# EAGLE design LoRa ST v1.0 (EAGLE 7.5.0)
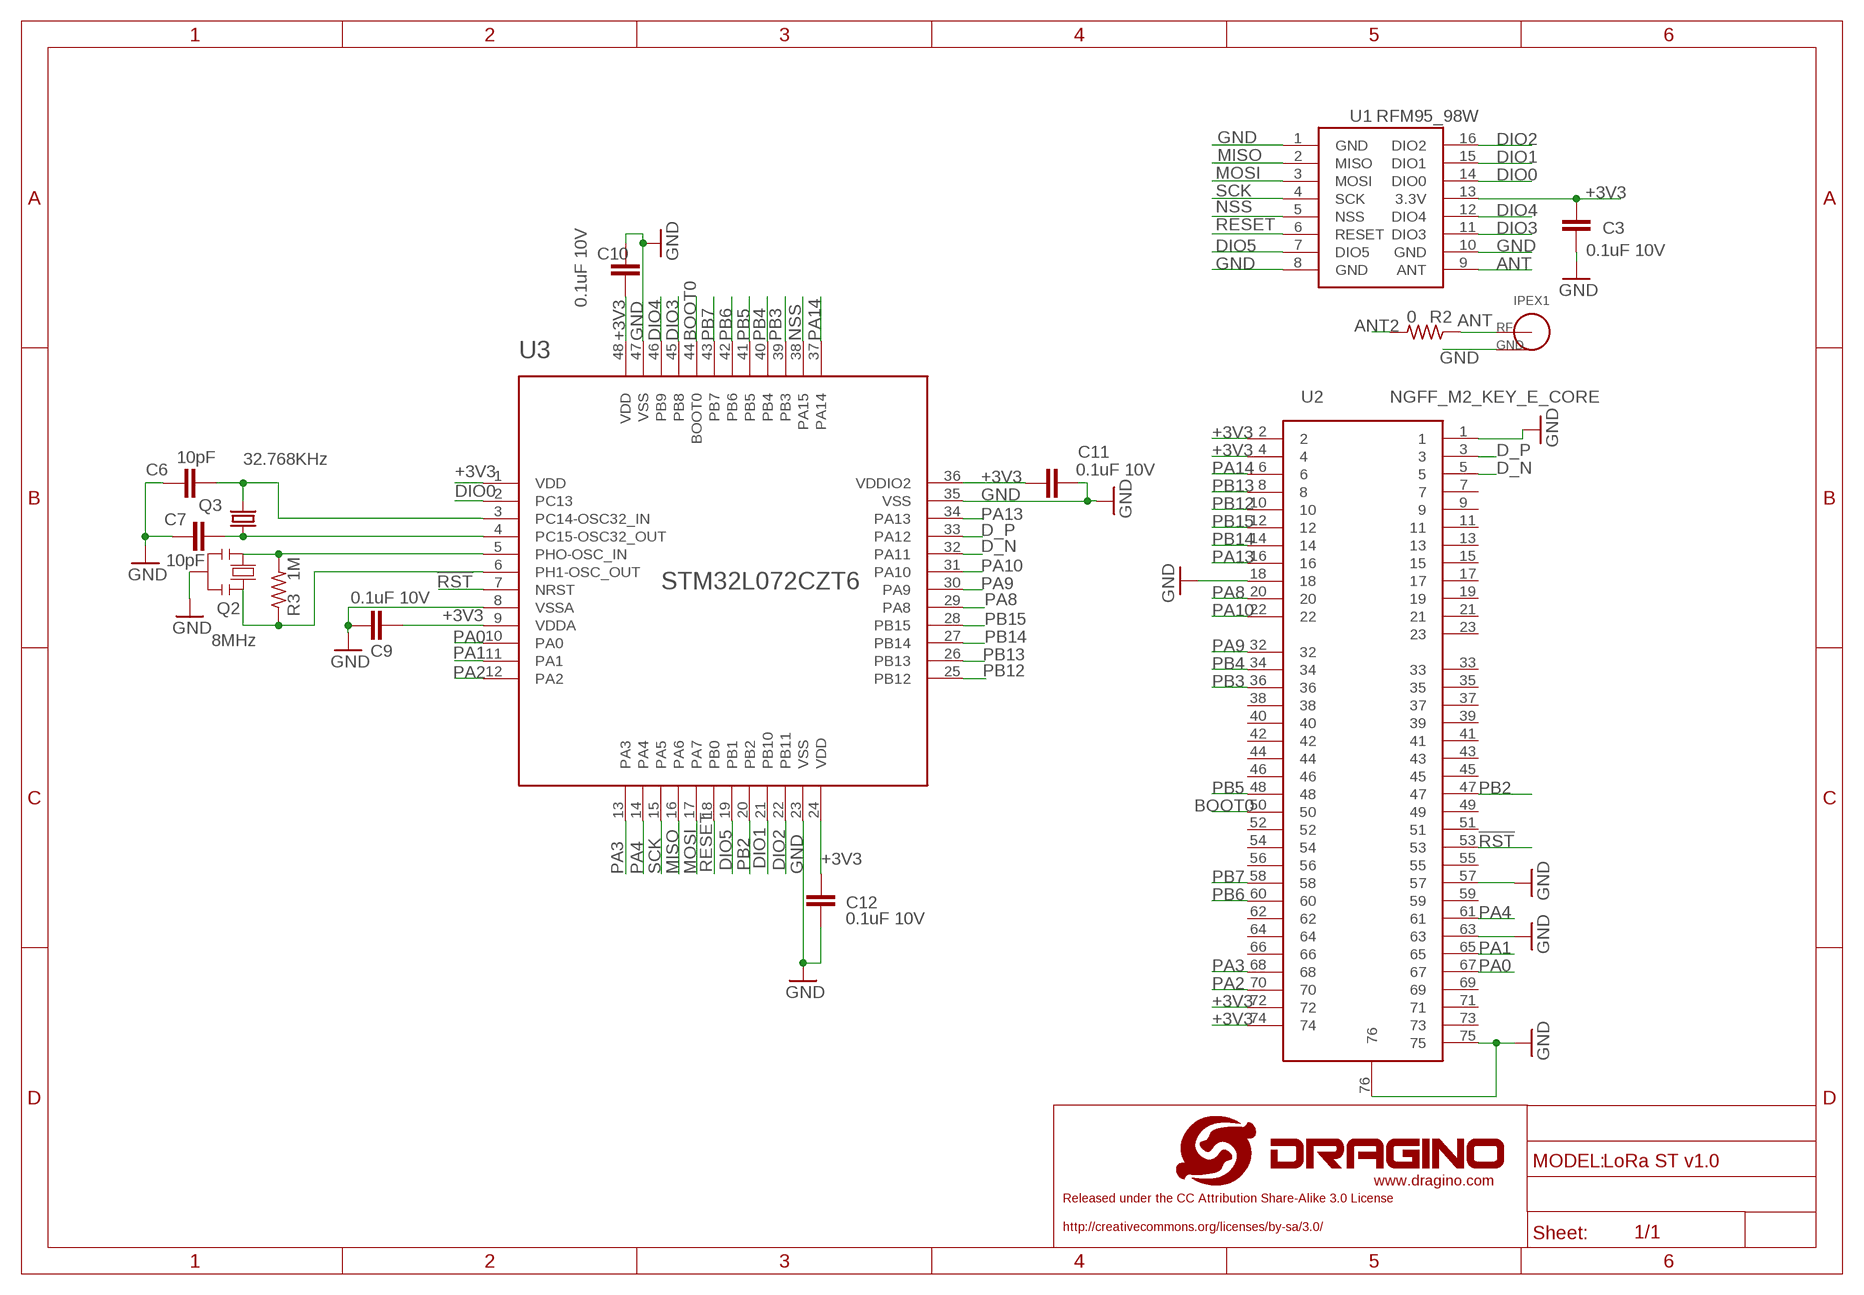
[diagram p0: schematic, sheet 1]

## Parts
C3  0.1uF 10V  C-EUC0402  [C0402]
C6  10pF  C-EUC0402  [C0402]
C7  10pF  C-EUC0402  [C0402]
C9  0.1uF 10V  C-EUC0402  [C0402]
C10  0.1uF 10V  C-EUC0402  [C0402]
C11  0.1uF 10V  C-EUC0402  [C0402]
C12  0.1uF 10V  C-EUC0402  [C0402]
IPEX1  I-PEX4  [I-PEX4]
Q2  8MHz  RESONATORMU  [RESONATOR]
Q3  32.768KHz  SMD-2012_2P  [32.768K]
R2  0  R-US_R0402  [R0402]
R3  1M  R-US_R0402  [R0402]
U1  RFM95_98W  [RFM95_98W]
U2  NGFF_M2_KEY_E_CORE  [LORA_ST_PCB]
U3  STM32L072CZT6  STM32L0XX  [LQFP48]
U$2  LOGO-NEW  [LOGO-SILK-NEW]

## Nets
!RST: U2.53 U3.7(NRST)
+3V3: C3.2 C9.1 C10.1 C11.2 C12.2 U1.13(3.3V) U2.2 U2.4 U2.72 U2.74 U3.1(VDD) U3.9(VDDA) U3.24(VDD) U3.36(VDDIO2) U3.48(VDD)
ANT [2layer-50ohm]: IPEX1.SIG R2.1 U1.9(ANT)
ANT2: R2.2
BOOT0: U2.50 U3.44(BOOT0)
D_N: U2.5 U3.32(PA11)
D_P: U2.3 U3.33(PA12)
DIO0: U1.14(DIO0) U3.2(PC13)
DIO1: U1.15(DIO1) U3.21(PB10)
DIO2: U1.16(DIO2) U3.22(PB11)
DIO3: U1.11(DIO3) U3.45(PB8)
DIO4: U1.12(DIO4) U3.46(PB9)
DIO5: U1.7(DIO5) U3.19(PB1)
GND: C3.1 C6.1 C7.1 C9.2 C10.2 C11.1 C12.1 IPEX1.GND1(GND) IPEX1.GND2(GND) IPEX1.GND3(GND) Q2.2 U1.1(GND) U1.8(GND) U1.10(GND) U2.1 U2.18 U2.57 U2.63 U2.75 U2.76 U3.8(VSSA) U3.23(VSS) U3.35(VSS) U3.47(VSS)
MISO: U1.2(MISO) U3.16(PA6)
MOSI: U1.3(MOSI) U3.17(PA7)
N$4: Q2.1 R3.2 U3.5(PHO-OSC_IN)
N$5: Q2.3 R3.1 U3.6(PH1-OSC_OUT)
N$6: C7.2 Q3.3 U3.4(PC15-OSC32_OUT)
N$7: C6.2 Q3.4 U3.3(PC14-OSC32_IN)
NSS: U1.5(NSS) U3.38(PA15)
PA0: U2.67 U3.10(PA0)
PA1: U2.65 U3.11(PA1)
PA2: U2.70 U3.12(PA2)
PA3: U2.68 U3.13(PA3)
PA4: U2.61 U3.14(PA4)
PA8: U2.20 U3.29(PA8)
PA9: U2.32 U3.30(PA9)
PA10: U2.22 U3.31(PA10)
PA13: U2.16 U3.34(PA13)
PA14: U2.6 U3.37(PA14)
PB2: U2.47 U3.20(PB2)
PB3: U2.36 U3.39(PB3)
PB4: U2.34 U3.40(PB4)
PB5: U2.48 U3.41(PB5)
PB6: U2.60 U3.42(PB6)
PB7: U2.58 U3.43(PB7)
PB12: U2.10 U3.25(PB12)
PB13: U2.8 U3.26(PB13)
PB14: U2.14 U3.27(PB14)
PB15: U2.12 U3.28(PB15)
RESET: U1.6(RESET) U3.18(PB0)
SCK: U1.4(SCK) U3.15(PA5)
Unconnected: U2.7 U2.9 U2.11 U2.13 U2.15 U2.17 U2.19 U2.21 U2.23 U2.33 U2.35 U2.37 U2.38 U2.39 U2.40 U2.41 U2.42 U2.43 U2.44 U2.45 U2.46 U2.49 U2.51 U2.52 U2.54 U2.55 U2.56 U2.59 U2.62 U2.64 U2.66 U2.69 U2.71 U2.73

## Library data of the parts
C3 C6 C7 C9-C12 = dragino-passive:C-EU: CAPACITOR, European symbol
IPEX1 = dragino-passive:I-PEX: I-PEX, U.F.L connector
Q2 = SmartPrj:RESONATOR
Q3 = crystal:SMD-2012_2P: kHz RANGE CRYSTAL UNIT SMD Source: MC-306_405_406_E07X.PDF Homepage <http://www.epsontoyocom.co.jp>
R2 R3 = dragino:R-US_: RESISTOR, American symbol
U1 = dragino:RFM95_98W
U2 = dragino:NGFF_M2_KEY_E
U3 = dragino:STM32L0XX
U$2 = dragino:LOGO-NEW

## Net classes
0 default: width 0.203 mm, clearance 0.203 mm
1 vcc: width 0.254 mm
2 gnd: width 0.305 mm, drill 0.254 mm, clearance 0.203 mm
3 2layer-50ohm: width 0.305 mm, clearance 0.203 mm

## Board
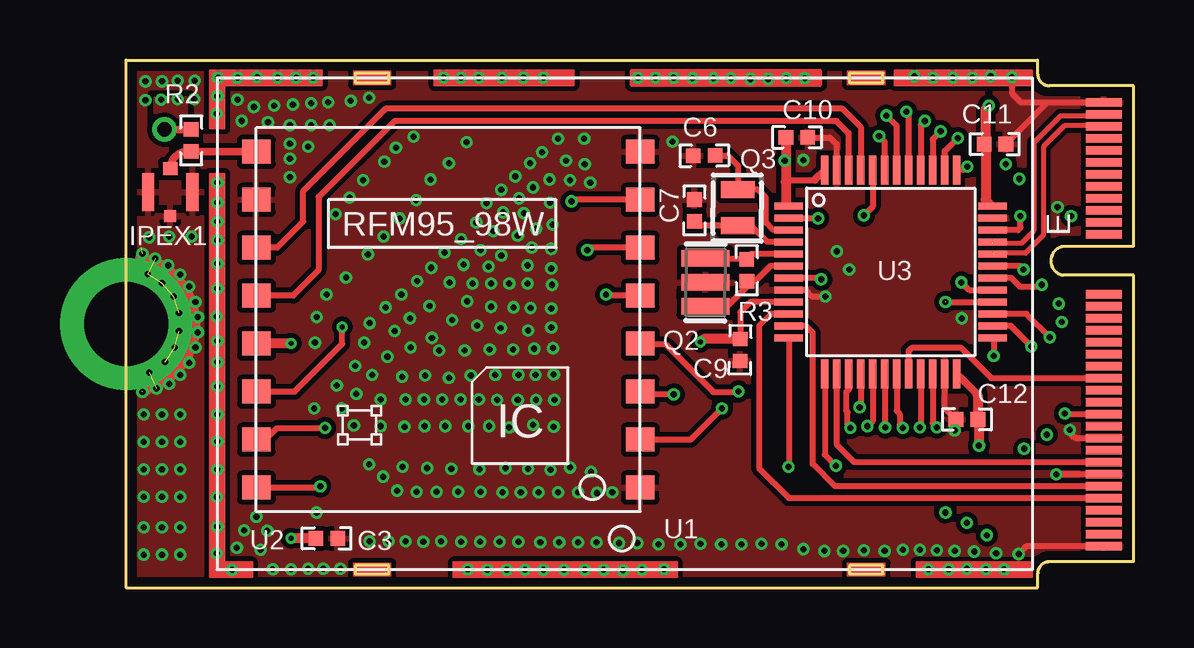
[diagram p1: board, top side]
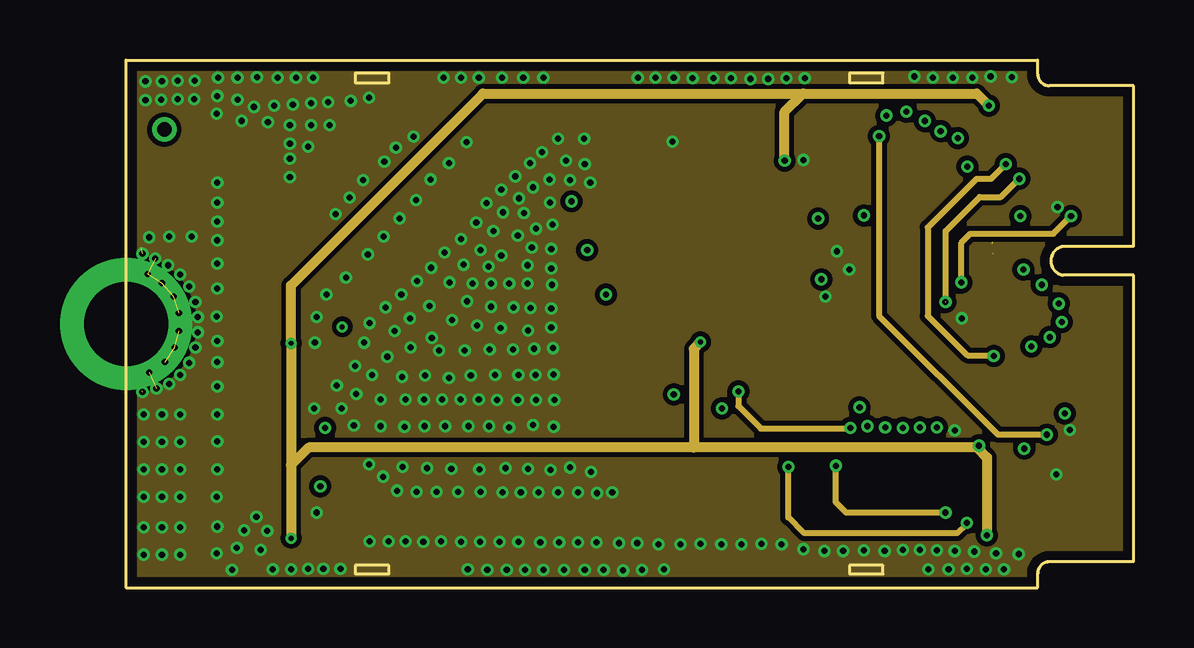
[diagram p2: board, inner layer Route2]
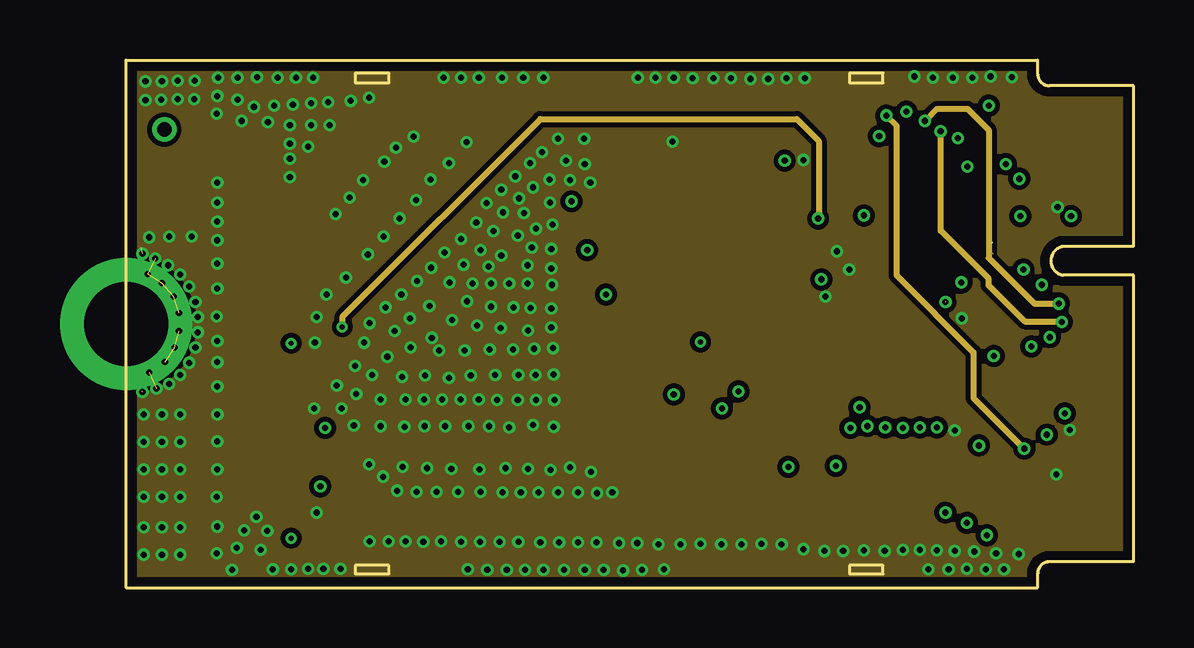
[diagram p3: board, inner layer Route15]
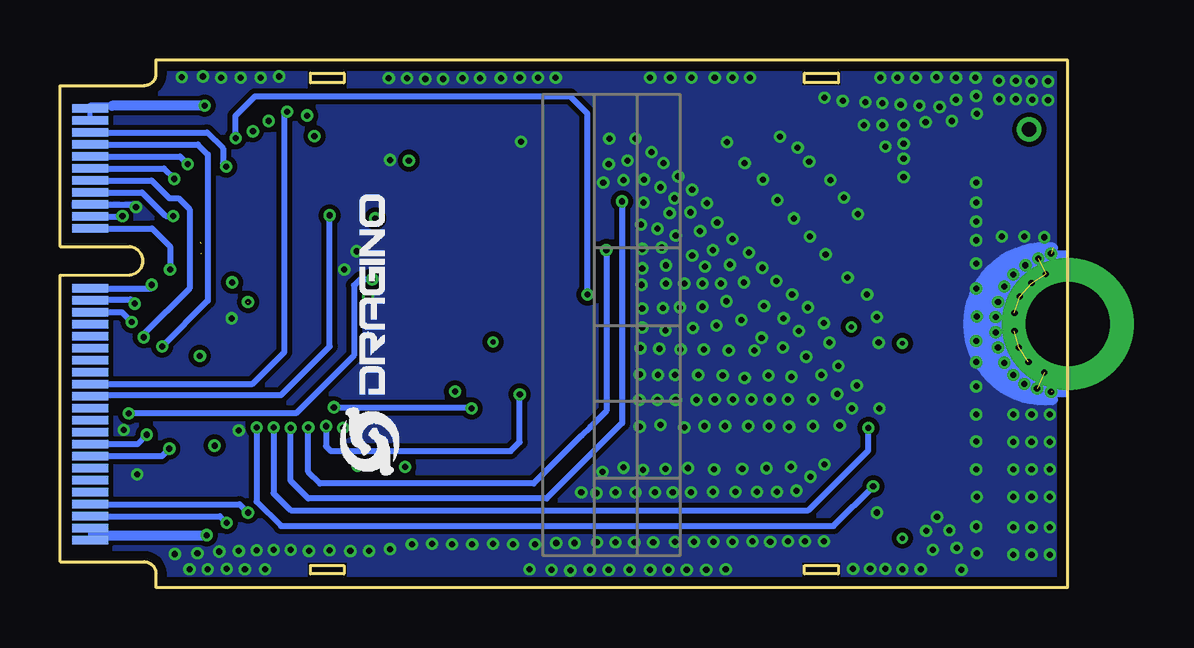
[diagram p4: board, bottom side, seen from below]

Size 42 x 22 mm. Coordinates in mm from the lower left corner, seen from the top.
Copper layers (1*2+15*16): Top 0.035mm / dielectric 1.5mm / Route2 0.035mm / dielectric 0.15mm / Route15 0.035mm / dielectric 0.2mm / Bottom 0.035mm
Design rules "default *": minimum track width 6mil, minimum drill 8mil, track to track 6mil, track to pad 6mil, pad to pad 6mil, via to via 6mil, smd to smd 6mil, copper to edge 15mil, drill to drill 8mil, minimum pad ring 5mil, minimum via ring 5mil, stop-mask expansion 4mil, vias tented up to drill 30mil, thermal gap 8mil
tRestrict: 4 lines

### Footprints (pad centres in the part's own frame; a part is rotated, then mirrored left to right if it is on the bottom)
C0402 = smd 0.61 x 0.61: 1 -0.457,0; 2 0.457,0
I-PEX4 = smd 0.508 x 1.58: GND1 -0.924,0; GND3 0.924,0 | smd 0.5 x 0.5: GND2 0,1 | smd 0.6 x 0.55: SIG 0,-0.975
RESONATOR = smd 0.7 x 2: 1 -1,0; 2 0,0; 3 1,0
32.768K = smd 0.7 x 1.4: 3 0.78,0.03; 4 -0.72,0.03
R0402 = smd 0.61 x 0.61: 1 -0.457,0; 2 0.457,0
RFM95_98W = smd 1.2 x 1: 1 -8,5.73; 2 -8,3.73; 3 -8,1.73; 4 -8,-0.27; 5 -8,-2.27; 6 -8,-4.27; 7 -8,-6.27; 8 -8,-8.27; 9 8,-8.27; 10 8,-6.27; 11 8,-4.27; 12 8,-2.27; 13 8,-0.27; 14 8,1.73; 15 8,3.73; 16 8,5.73
LORA_ST_PCB = smd 0.35 x 1.5: 1 20.225,-40.75; 3 19.725,-40.75; 5 19.225,-40.75; 7 18.725,-40.75; 9 18.225,-40.75; 11 17.725,-40.75; 13 17.227,-40.75; 15 16.725,-40.75; 17 16.225,-40.75; 19 15.725,-40.75; 21 15.225,-40.75; 23 14.725,-40.75; 33 12.225,-40.75; 35 11.725,-40.75; 37 11.225,-40.75; 39 10.725,-40.75; 41 10.225,-40.75; 43 9.725,-40.75; 45 9.225,-40.75; 47 8.725,-40.75; 49 8.225,-40.75; 51 7.725,-40.75; 53 7.225,-40.75; 55 6.725,-40.75; 57 6.225,-40.75; 59 5.725,-40.75; 61 5.225,-40.75; 63 4.725,-40.75; 65 4.225,-40.75; 67 3.725,-40.75; 69 3.225,-40.75; 71 2.725,-40.75; 73 2.225,-40.75; 75 1.725,-40.75 | smd 0.35 x 1.5 bottom: 2 19.975,-40.75; 4 19.475,-40.75; 6 18.975,-40.75; 8 18.475,-40.75; 10 17.975,-40.75; 12 17.475,-40.75; 14 16.975,-40.75; 16 16.475,-40.75; 18 15.975,-40.75; 20 15.475,-40.75; 22 14.975,-40.75; 32 12.475,-40.75; 34 11.975,-40.75; 36 11.475,-40.75; 38 10.975,-40.75; 40 10.475,-40.75; 42 9.975,-40.75; 44 9.475,-40.75; 46 8.975,-40.75; 48 8.475,-40.75; 50 7.975,-40.75; 52 7.475,-40.75; 54 6.975,-40.75; 56 6.475,-40.75; 58 5.975,-40.75; 60 5.475,-40.75; 62 4.975,-40.75; 64 4.475,-40.75; 66 3.975,-40.75; 68 3.475,-40.75; 70 2.975,-40.75; 72 2.475,-40.75; 74 1.975,-40.75 | drill 3.5 pad 5.5: 76 11,0
LQFP48 = smd 1.2 x 0.3: 1 -4.25,2.75; 2 -4.25,2.25; 3 -4.25,1.75; 4 -4.25,1.25; 5 -4.25,0.75; 6 -4.25,0.25; 7 -4.25,-0.25; 8 -4.25,-0.75; 9 -4.25,-1.25; 10 -4.25,-1.75; 11 -4.25,-2.25; 12 -4.25,-2.75; 25 4.25,-2.75; 26 4.25,-2.25; 27 4.25,-1.75; 28 4.25,-1.25; 29 4.25,-0.75; 30 4.25,-0.25; 31 4.25,0.25; 32 4.25,0.75; 33 4.25,1.25; 34 4.25,1.75; 35 4.25,2.25; 36 4.25,2.75 | smd 0.3 x 1.2: 13 -2.75,-4.25; 14 -2.25,-4.25; 15 -1.75,-4.25; 16 -1.25,-4.25; 17 -0.75,-4.25; 18 -0.25,-4.25; 19 0.25,-4.25; 20 0.75,-4.25; 21 1.25,-4.25; 22 1.75,-4.25; 23 2.25,-4.25; 24 2.75,-4.25; 37 2.75,4.25; 38 2.25,4.25; 39 1.75,4.25; 40 1.25,4.25; 41 0.75,4.25; 42 0.25,4.25; 43 -0.25,4.25; 44 -0.75,4.25; 45 -1.25,4.25; 46 -1.75,4.25; 47 -2.25,4.25; 48 -2.75,4.25

### Placement (x,y rotation side)
C3  8.37,2.05 180 top
C6  24.1,18.01 0.6 top
C7  23.7,15.72 270 top
C9  25.6,9.91 269.2 top
C10  27.97,18.77 0 top
C11  36.22,18.49 180 top
C12  35.05,7.01 0 top
IPEX1  1.85,16.5 180 top
Q2  24.16,12.73 269.7 top
Q3  25.48,15.88 269.8 top
R2  2.72,18.64 90 top
R3  25.88,13.23 90.1 top
U1  13.44,9.91 180 top
U2  0,0 90 top
U3  31.88,13.16 0 top
U$1  [LORA_ST]  3.8,0.75 0 top
U$2  27.86,4.67 90 bottom

### Tracks (layer width: path | path; a pad name or v marks a point on that pad's centre or on a via)
!RST  (via drill 0.25 pad 0.25)
  Top 0.254: 39.18,7.23 v39.14,7.26 39.14,7.23 U2.53 | U3.7 27.63,12.89 27.67,12.93 28.91,12.93 arc-90 v28.98,12.85
  Bottom 0.254: v28.98,12.85 29.49,12.85 29.74,12.6 29.74,9.68 32.16,7.26 v39.14,7.26
+3V3  (via drill 0.2 pad 0.25, 0.25, 0.25 pad 0.25)
  Top 0.254: 35.46,7.06 C12.2 35.56,6.96 | 35.84,18.42 C11.2 | v6.89,2.05 v6.88,2.06 | v27.46,17.81 27.51,17.81 | 27.51,16.92 27.56,16.96 28.73,16.96 28.73,17.01 | 25.63,10.38 C9.1 25.61,11.49 26.04,11.91 U3.9 | U3.1 27.59,15.91 27.51,15.99
  Top 0.305: U3.36 35.84,16.19 | U3.24 35.51,8.03 | 28.73,17.01 U3.48
  Top 0.406: C10.1 27.51,17.81 27.51,16.92 27.51,15.99 | C3.2 v6.89,2.05 | v6.88,10.19 U1.13 | v35.97,20.09 35.84,19.96 35.84,18.49 | 35.84,18.49 35.84,16.19 | C11.2 35.84,18.49 | 35.51,8.03 C12.2 | 35.56,6.96 v35.56,5.92 | C9.1 24.08,10.36 v23.95,10.24
  Top 0.508: U1.13
  Route2 0.406: v27.46,17.81 27.46,19.84 28.22,20.6 | 28.22,20.6 35.46,20.6 v35.97,20.09 | 28.22,20.6 14.88,20.6 6.88,12.6 v6.88,10.19 6.88,5.11 | 6.88,5.11 v6.88,2.06 | v35.56,5.92 35.48,5.84 | 35.48,5.84 35.89,5.44 v35.89,2.18 | 35.48,5.84 23.67,5.84 | 23.67,5.84 7.62,5.84 6.88,5.11 | v23.95,10.24 23.67,9.96 23.67,5.84
  Bottom 0.203: U2.72 U2.74 | U2.4 U2.2
  Bottom 0.254: 39.83,20.09 40.74,20.09 | U2.2 40.75,20.09 40.74,20.09 | 40.74,20.09 40.74,19.89 40.77,19.89 | U2.72 40.46,2.18
  Bottom 0.406: v35.97,20.09 39.83,20.09 | 40.46,2.18 v35.89,2.18
ANT
  Top 0.305: U1.9 2.72,18.18 | 2.55,18.18 arc90 IPEX1.SIG
  Top 0.406: R2.1 2.72,18.18 2.55,18.18
ANT2  (via drill 0.6 pad 1.02)
  Top 0.305: R2.2 v1.6,19.1
BOOT0  (via drill 0.25 pad 0.25)
  Top 0.254: U3.44 31.13,15.89 v30.76,15.52
  Bottom 0.254: U2.50 40.75,8.03 32.79,8.03 30.76,10.06 v30.76,15.52
D_N  (1 unrouted)
  Top 0.203: U2.5 40.72,19.25 39.12,19.25 38.25,18.38 38.25,14.7 37.49,13.94 36.12,13.94
D_P  (1 unrouted)
  Top 0.203: U2.3 40.68,19.66 38.96,19.66 37.84,18.54 37.84,14.87 37.32,14.35 36.12,14.35
DIO0  (via drill 0.2 pad 0.25, 0.25 pad 0.25)
  Top 0.254: U1.14 7.03,8.18 9.02,10.16 v9.02,10.87 | v28.85,15.39 27.64,15.39 U3.2
  Route15 0.254: v28.85,15.39 28.88,15.42 28.88,18.62 27.97,19.53 17.27,19.53 9.02,11.28 v9.02,10.87
DIO1  (via drill 0.25)
  Top 0.254: U3.21 33.13,6.71 v33.1,6.68 | U1.15 5.82,6.18 6.3,6.65 v8.31,6.65
  Bottom 0.254: v33.1,6.68 33.1,3.94 32.39,3.23 10.8,3.23 8.31,5.72 v8.31,6.65
DIO2  (via drill 0.25)
  Top 0.254: U3.22 33.63,6.86 v33.81,6.68 | U1.16 8.06,4.18 v8.1,4.22
  Bottom 0.254: v33.81,6.68 33.81,3.58 32.79,2.57 9.75,2.57 v8.1,4.22
DIO3
  Top 0.254: U1.11 6.3,14.18 7.39,15.27 7.39,16.54 10.82,19.96 29.87,19.96 30.63,19.2 U3.45
DIO4
  Top 0.254: U1.12 6.97,12.18 8.03,13.23 8.03,16.28 11.2,19.46 29.62,19.46 30.12,18.95 U3.46
DIO5  (via drill 0.25)
  Top 0.254: U3.19 32.13,7.37 32.26,7.24 32.26,6.78 v32.39,6.65 | U1.7 18.64,16.18 v18.57,16.1
  Bottom 0.254: v32.39,6.65 32.39,4.45 31.65,3.71 21.72,3.71 18.57,6.86 v18.57,16.1
GND  (via drill 0.25)  (9 unrouted)
  Top 0.254: 36.73,18.49 C11.1 38.41,20.23 | U2.57 39.7,6.23 arc-90 v39.34,6.58 | C10.2 29.34,18.77 29.62,18.49 U3.47 | C12.1 34.13,7.48 U3.23 | U2.1 38.41,20.23 | 38.41,20.23 37.33,20.23 36.96,20.6 36.96,21.26 v36.93,21.29 | U3.8 27.64,12.42 28.32,12.42 28.6,12.14 v29.16,12.14 | U2.63 v38.79,4.73 v38.79,4.72 | U2.75 37.54,1.73 v37.21,1.4
  Top 0.406: 0.61,13.77 arc-156 0.66,8.2
  Bottom 0.254: U2.18 38.94,15.98 v38.83,15.87
  Bottom 0.406: 0.61,14.17 arc-192 0.61,7.82
  other vias: 22.78,18.59 28.24,17.83 29.64,14.02 1.75,13.44 2.26,13.06 2.64,12.55 2.9,11.91 3,11.28 3,10.64 2.9,10.01 2.64,9.37 2.26,8.86 1.8,8.48 3.81,12.47 3.78,11.3 3.81,10.29 3.81,9.4 3.81,16.89 5.33,20.04 5.92,19.41 6.83,19.28 7.72,19.28 8.48,19.28 3.81,16.05 30.15,13.26 34.85,11.23 11.61,6.71 12.45,6.73 13.31,6.73 14.27,6.73 0.74,7.21 1.5,7.21 2.26,7.21 3.81,7.21 3.81,8.38 0.74,6.07 1.5,6.07 2.26,6.07 3.81,6.1 0.74,4.93 1.5,4.93 2.26,4.93 3.81,4.93 0.74,3.78 1.5,3.78 2.26,3.78 3.78,3.78 0.74,2.51 1.5,2.51 2.26,2.51 3.81,2.54 0.74,1.37 1.5,1.37 2.26,1.37 3.78,1.42 4.42,0.74 4.93,2.39 3.81,13.51 15.06,0.74 15.88,0.74 16.64,0.74 14.45,12.67 11.99,18.8 9.88,16.99 9.32,16.26 6.83,17.88 7.59,18.39 6.83,18.52 6.83,17.12 11.51,8.79 12.47,8.84 13.46,8.74 14.38,8.84 15.39,8.86 11.66,7.85 12.42,7.85 13.18,7.85 13.94,7.85 14.71,7.85 15.16,9.93 16.13,9.93 17.02,9.96 17.81,9.98 15.21,12.67 15.98,12.67 16.74,12.67 17.4,0.74 18.26,0.74 34.29,0.76 35.05,0.79 35.84,0.76 36.6,0.76 4.65,21.26 5.46,21.29 6.32,21.26 9.37,20.29 10.13,20.42 7.09,21.26 36.04,21.31 13.23,21.26 13.97,21.26 14.71,21.26 15.67,21.26 16.56,21.26 17.4,21.26 21.34,21.26 22.07,21.26 22.83,21.26 23.62,21.23 24.49,21.23 25.22,21.23 26.04,21.21 26.77,21.21 27.53,21.23 28.3,21.23 32.87,21.31 33.63,21.26 34.47,21.26 35.28,21.26 10.62,6.73 10.62,7.85 10.26,8.86 10.9,9.63 13.06,9.88 14.12,9.88 3.81,14.48 7.85,7.47 10.77,17.75 4.65,20.35 3.81,15.27 8.43,20.24 7.72,20.19 6.96,20.14 6.17,20.09 7.8,21.26 34.54,6.55 33.45,0.76 12.4,1.9 13.13,1.93 13.97,1.9 14.76,1.9 15.57,1.9 16.36,1.9 11.66,1.93 10.95,1.93 10.16,1.93 17.27,1.88 18.06,1.88 18.85,1.88 19.61,1.88 20.55,1.85 21.31,1.85 22.2,1.8 23.11,1.8 23.95,1.83 24.82,1.8 25.65,1.8 26.49,1.83 27.33,1.8 28.24,1.6 29.11,1.52 29.9,1.52 30.76,1.55 31.62,1.52 32.38,1.57 33.1,1.57 33.81,1.55 34.54,1.52 35.36,1.5 36.27,1.42 5.89,2.36 4.62,1.65 5.61,1.57 6.12,0.76 6.88,0.76 7.59,0.79 8.23,0.79 8.94,0.79 5.44,2.95 7.95,3.12 11.3,4.04 12.12,3.99 12.95,3.99 13.84,3.99 14.78,3.99 15.7,3.96 16.46,3.96 17.2,3.96 18.01,3.96 18.85,3.96 19.63,3.94 20.27,3.96 10.72,4.62 10.13,5.13 11.53,5.03 12.55,4.98 13.56,4.95 14.73,4.93 15.82,4.98 16.76,4.95 17.7,4.9 18.52,5 19.38,4.83 17.83,6.71 16.97,6.78 15.98,6.68 15.14,6.73 15.47,7.82 16.33,7.82 17.09,7.82 17.86,7.82 16.36,8.86 17.83,8.89 17.07,8.86 8.79,8.43 9.55,9.25 9.6,8.08 9.5,6.76 8.99,7.47 9.93,10.21 10.16,11.02 10.82,11.68 11.48,12.22 12.14,12.78 12.73,13.33 13.28,13.97 13.97,14.53 14.61,15.21 15.04,16.03 15.65,16.59 16.23,17.14 16.84,17.7 17.35,18.16 18.01,18.72 19.1,18.72 19.13,17.65 19.35,16.89 18.34,17.81 17.65,17.02 18.52,16.99 17.68,16.05 16.97,16.69 16.38,16.23 15.72,15.65 16.59,15.62 15.32,14.86 17.78,15.14 17.73,14.12 17.73,13.31 17.75,12.62 16.74,13.44 16.92,14.17 17.09,14.96 16.33,14.68 13.49,12.73 14.07,13.46 14.78,14.07 15.65,13.84 15.11,13.39 12.65,11.73 11.84,11.23 11.2,10.69 11.86,10.01 12.75,10.41 13.59,11.15 14.22,11.94 15.21,11.71 14.63,10.92 15.62,10.82 16.15,11.68 16.87,11.66 17.73,11.63 17.73,10.85 16.76,10.72 8.74,15.57 11.25,18.34 14.2,18.57 13.46,17.7 12.7,17.02 12.09,16.15 11.4,15.39 10.74,14.63 10.08,13.89 9.17,12.93 8.36,12.22 7.95,11.28 7.87,10.21 14.25,0.76 19.13,0.74 19.91,0.74 20.73,0.71 21.51,0.74 22.43,0.76 1.22,13.72 0.69,13.92 0.69,8.15 1.27,8.31 0.91,13.08 1.5,12.7 1.98,12.14 2.21,11.46 2.21,10.69 2.03,10.01 1.63,9.4 0.97,8.97 3.84,21.26 3.81,20.5 3.78,19.76 4.83,19.46 0.97,14.61 1.8,14.63 2.74,14.63 0.81,20.32 1.47,20.35 2.16,20.37 2.84,20.37 0.81,21.11 1.5,21.11 2.16,21.13 2.87,21.13
  pour Route15: 0.03,22 38,22 38,21.41 arc90 38.51,20.9 42.01,20.9 42.01,14.2 39.17,14.2 arc90 38.58,13.61 38.58,13.54 arc90 39.09,13.03 41.96,13.03 41.96,1.02 38.35,1.02 arc90 38,0.66 38,0.03 0.03,0.03
  pour Bottom: 0.03,22 38,22 38,21.49 arc90 38.58,20.9 42.01,20.9 42.01,14.22 39.14,14.22 39.14,14.25 arc90 38.58,13.69 38.58,13.56 arc90 39.14,13 arc-1 41.94,12.98 41.94,1.09 38.56,1.09 arc90 38,0.53 38,0.03 0.03,0.03
  pour Top: 0.03,22 38,22 38,21.38 arc90 38.47,20.91 41.96,20.91 41.96,14.22 39.16,14.22 arc90 38.58,13.65 38.58,13.54 arc90 39.11,13.01 42.05,13.01 42.05,1.05 38.53,1.05 arc90 37.97,0.5 37.97,-0.1 0.03,-0.1
  pour Route2: 0.03,22 38,22 38,21.36 arc90 38.45,20.91 41.97,20.91 41.97,14.34 41.98,14.34 41.98,14.25 39.14,14.25 arc90 38.55,13.66 38.55,13.61 arc90 39.13,13.04 41.98,13.04 41.98,1.05 38.55,1.05 arc90 37.94,0.44 37.94,0.01 -0.01,0.01 -0.01,1.69 0.03,1.69
MISO  (via drill 0.25)
  Top 0.254: U3.16 30.63,7.56 v30.58,7.52 | U1.2 23.55,6.18 v24.84,7.47
  Bottom 0.254: v30.58,7.52 24.89,7.52 v24.84,7.47
MOSI  (via drill 0.25)
  Top 0.254: U3.17 31.13,6.95 v30.91,6.73 | v22.83,8.05 21.56,8.05 U1.3
  Bottom 0.254: v30.91,6.73 30.91,5.89 30.71,5.69 23.22,5.69 22.83,6.07 v22.83,8.05
N$4
  Top 0.254: U3.5 26.1,13.91 arc90 R3.2 24.2,13.69 Q2.1
N$5
  Top 0.254: U3.6 26.87,13.41 26.24,12.78 R3.1 25.88,12.55 25.07,11.73 Q2.3
N$6
  Top 0.254: U3.4 26.74,14.41 26.11,15.04 25.56,15.04 Q3.3 23.87,15.09 C7.2
N$7
  Top 0.254: U3.3 26.98,14.91 26.67,15.21 26.67,16.26 26.34,16.59 Q3.4 25.5,16.6 25.5,17.6 25.09,18.01 C6.2
NSS  (via drill 0.25)
  Top 0.254: U3.38 34.13,18.2 v34.67,18.75 | U1.5 20.06,12.18 v20.02,12.22
  Bottom 0.254: v20.02,12.22 20.02,19.76 20.73,20.47 33.88,20.47 34.7,19.66 34.7,18.77 v34.67,18.75
PA0
  Top 0.254: U3.10 26.88,11.41 26.39,10.92 26.39,4.98 27.64,3.73 40.74,3.73 U2.67
PA1
  Top 0.254: U2.65 29.56,4.23 28.63,5.16 28.63,10.62 28.35,10.9 27.64,10.9 U3.11
PA2  (via drill 0.25)
  Top 0.254: U3.12 27.63,5.05 v27.61,5.03
  Route2 0.254: v35.05,2.69 35.03,2.69 35.03,2.64 34.65,2.26 28.27,2.26 27.61,2.92 v27.61,5.03
  Bottom 0.254: U2.70 35.33,2.98 v35.05,2.69
PA3  (via drill 0.25)
  Top 0.254: U3.13 29.13,5.54 v29.59,5.08
  Route2 0.254: v34.16,3.12 30.02,3.12 29.59,3.56 v29.59,5.08
  Bottom 0.254: U2.68 34.51,3.48 v34.16,3.12
PA4
  Top 0.254: U2.61 30.36,5.23 29.64,5.94 29.64,8.89 U3.14
PA8  (via drill 0.25)
  Top 0.254: v34.82,12.73 35.14,12.41 U3.29
  Route2 0.254: v34.82,12.73 34.82,14.38 35.2,14.76 38.66,14.76 v39.4,15.49
  Bottom 0.254: U2.20 39.41,15.48 v39.4,15.49
PA9  (via drill 0.25)
  Top 0.254: v38.18,12.62 38.1,12.55 37.26,12.55 36.9,12.91 U3.30
  Bottom 0.254: 38.33,12.48 v38.18,12.62 38.18,12.48 U2.32
PA10  (via drill 0.25)
  Top 0.254: 37.27,13.4 v37.41,13.26 37.27,13.41 U3.31
  Bottom 0.254: v37.41,13.26 37.41,14.22 38.17,14.98 U2.22
PA13  (via drill 0.25)
  Top 0.254: U3.34 37.18,14.91 37.18,14.9 37.29,15.01 v37.29,15.49
  Bottom 0.203: 37.62,15.52 37.59,15.49
  Bottom 0.254: 37.62,15.52 38.57,16.48 U2.16 | 37.59,15.49 v37.29,15.49
PA14  (via drill 0.25 pad 0.25)
  Top 0.254: v35.08,17.55 34.93,17.41 U3.37
  Bottom 0.254: v35.08,17.55 35.2,17.68 35.2,18.31 35.87,18.98 U2.6
PB2
  Top 0.254: U3.20 32.63,9.87 32.77,10.01 34.8,10.01 36.07,8.74 40.74,8.74 U2.47
PB3  (via drill 0.25)
  Top 0.254: U3.39 33.63,18.69 v33.96,19.02
  Route15 0.254: 38.94,11.07 v39.01,11.07 38.99,11.1 37.47,11.1 35.97,12.6 35.97,12.88 33.96,14.88 v33.96,19.02
  Bottom 0.254: U2.36 40.16,11.48 | 40.16,11.48 39.42,11.48 v39.01,11.07 39.04,11.07 | U2.36 40.16,11.48
PB4  (via drill 0.25)
  Top 0.254: v33.3,19.46 33.13,19.28 U3.40
  Route15 0.254: v33.3,19.46 33.81,19.96 35.08,19.96 35.97,19.08 35.97,13.74 37.87,11.84 v38.89,11.84
  Bottom 0.254: 40.71,12.01 40.16,12.01 | U2.34 40.2,11.98 40.16,12.01 | 40.16,12.01 39.07,12.01 v38.89,11.84
PB5  (via drill 0.25 pad 0.25)
  Top 0.254: 32.63,19.74 v32.54,19.84 32.63,19.75 U3.41
  Bottom 0.254: v32.54,19.84 32.64,19.74 32.64,9.83 33.99,8.48 U2.48
PB6  (via drill 0.25)
  Top 0.254: U3.42 32.13,19.26 v31.7,19.69
  Route15 0.254: v31.7,19.69 32.13,19.25 32.13,13.03 32.16,13 32.16,12.98 35.33,9.8 35.33,7.9 v37.44,5.79
  Bottom 0.254: v37.44,5.79 37.76,5.48 U2.60
PB7  (via drill 0.25)
  Top 0.254: U3.43 31.63,18.59 v31.39,18.82
  Route2 0.254: v31.39,18.82 31.39,11.33 36.35,6.38 v38.38,6.38 36.47,6.38
  Bottom 0.254: v38.38,6.38 38.78,5.98 U2.58 40.67,5.98 40.67,5.99
PB12  (via drill 0.25)
  Top 0.254: U3.25 36.17,10.36 v36.17,9.65
  Route2 0.254: v36.17,9.65 36.17,9.68 35.08,9.68 33.43,11.33 33.43,15.01 35.46,17.04 36.07,17.04 v36.68,17.65
  Bottom 0.254: U2.10 37,17.98 v36.68,17.65
PB13  (via drill 0.25)
  Top 0.254: v37.74,10.06 36.9,10.91 U3.26
  Bottom 0.254: v37.74,10.06 35.84,11.96 35.84,18.06 36.26,18.48 U2.8
PB14  (via drill 0.25)
  Top 0.254: v38.51,10.44 37.54,11.41 U3.27
  Bottom 0.254: v38.51,10.44 38.51,10.57 36.6,12.47 36.6,15.77 37.06,16.23 37.44,16.23 38.18,16.98 U2.14
PB15  (via drill 0.25)  (1 unrouted)
  Top 0.254: v34.17,11.9 v34.17,11.91 U3.28
  Route2 0.254: v37.24,17.04 36.47,16.28 35.59,16.28 34.19,14.88 34.16,14.88 v34.16,11.91
  Bottom 0.254: v37.24,17.04 37.67,17.48 U2.12
RESET  (via drill 0.25)
  Top 0.254: U3.18 31.63,6.7 v31.65,6.68 | U1.6 19.33,14.18 v19.23,14.07
  Bottom 0.254: v31.65,6.68 31.65,4.83 31.17,4.34 22.25,4.34 20.26,6.34 19.89,6.71 19.23,7.37 v19.23,14.07
SCK  (via drill 0.25)
  Top 0.254: v30.2,6.65 30.07,6.78 30.07,7.32 30.02,7.37 30.02,8.15 30.15,8.28 30.15,8.88 U3.15 | v25.53,8.18 25.5,8.15 24.49,8.15 22.5,10.13 21.48,10.13 U1.4
  Route2 0.254: v25.53,8.18 25.53,7.57 26.47,6.63 30.18,6.63 v30.2,6.65

### Text on the board
tPlace: E
bDocu: LoRa ST v1.0 | 920-925 | 915 | 868 | Frequency | 470 | 433